# EAGLE design RS485-LoRa Wireless Station-V2.1 (EAGLE 6.1)
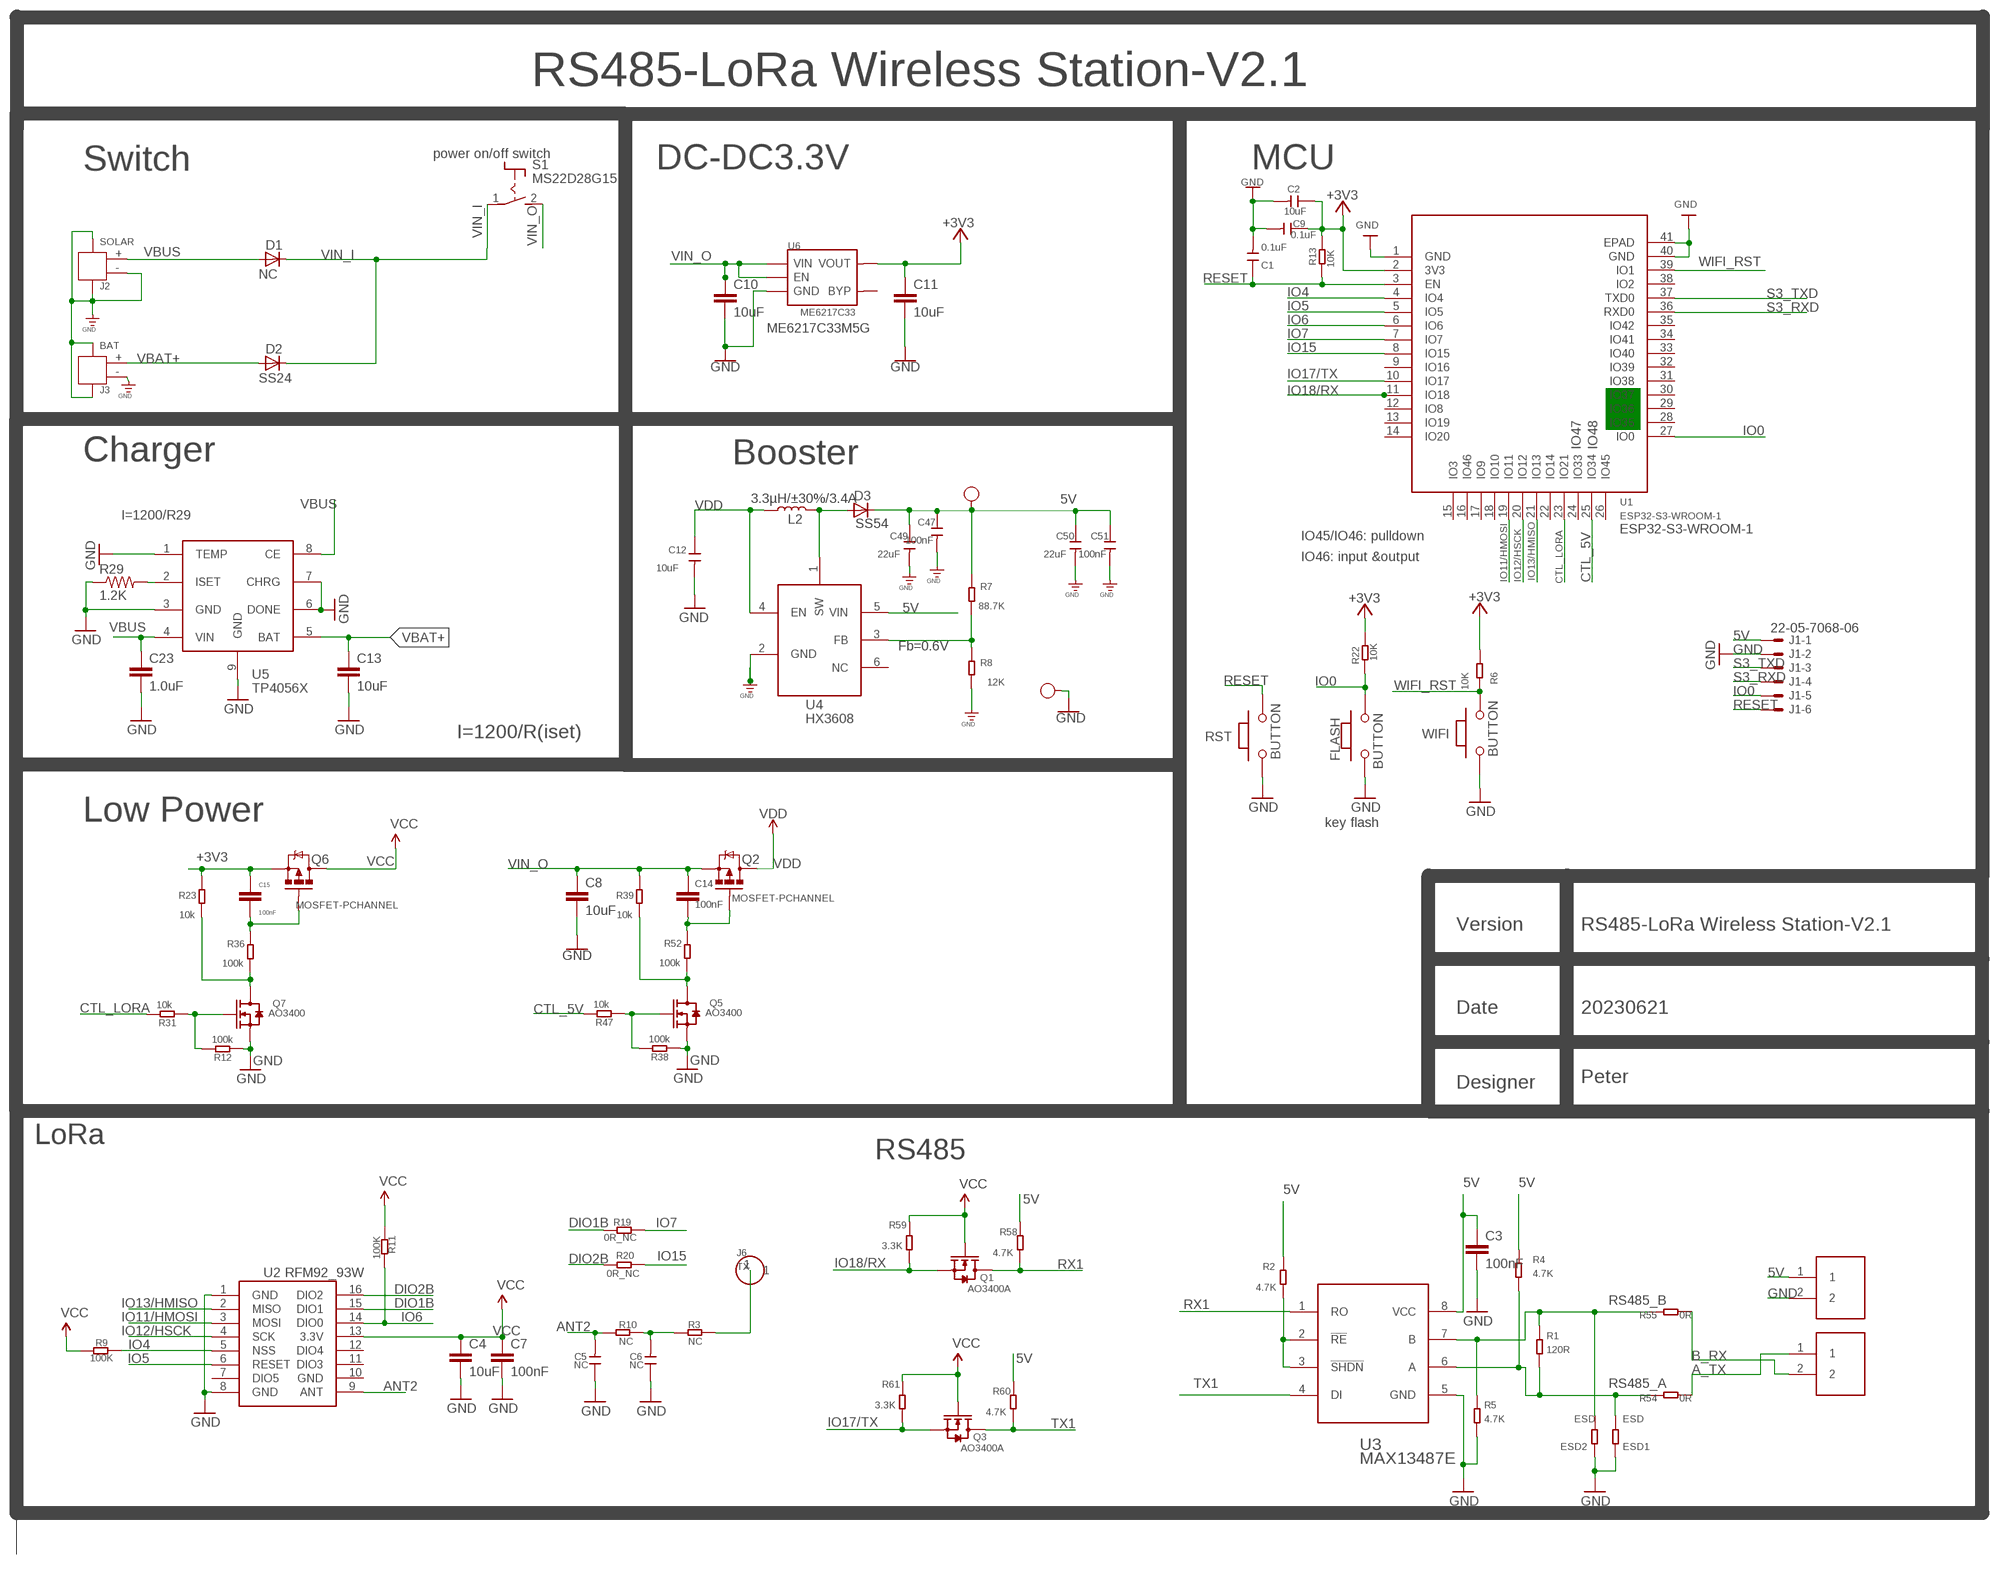
[diagram p0: schematic, sheet 1]

## Parts
5V  HP  TEST-POINT'4545'  [TP-D45MIL]
C1  0.1uF  DISCRETE_C-0603  [DISCRETE_C0603]
C2  10uF  DISCRETE_C-0603  [DISCRETE_C0603]
C3  100nF  C0603  [C0603]
C4  10uF  C0603  [C0603]
C5  NC  DISCRETE_C-0603  [DISCRETE_C0603]
C6  NC  DISCRETE_C-0603  [DISCRETE_C0603]
C7  100nF  C0603  [C0603]
C8  10uF  C0603  [C0603]
C9  0.1uF  DISCRETE_C-0603  [DISCRETE_C0603]
C10  10uF  C0603  [C0603]
C11  10uF  C0603  [C0603]
C12  10uF  CAP-0603  [C0603]
C13  10uF  C0603  [C0603]
C14  100nF  C0603  [C0603]
C15  100nF  C0603  [C0603]
C23  1.0uF  C0603  [C0603]
C47  100nF  CAP-0603  [C0603]
C49  22uF  CAP-0603  [C0603]
C50  22uF  CAP-0603  [C0603]
C51  100nF  CAP-0603  [C0603]
D1  NC  DIODE-DO-214AC  [DO-214AC]
D2  SS24  DIODE-DO-214AC  [DO-214AC]
D3  SS54  DIODE-DO-214AC  [DO-214AC]
ESD1  ESD  R-0603  [R0603]
ESD2  ESD  R-0603  [R0603]
FLASH  BUTTON  PB157  [157SW]
GND  HP  TEST-POINT'4545'  [TP-D45MIL]
J1  22-05-7068-06  [7395-06]
J2  SOLAR  JST-2P-SMD'2.0'  [HW2-SMD-2.0-90D]
J3  BAT  JST-2P-SMD'2.0'  [HW2-SMD-2.0-90D]
J4  PH2.0-2P-DIP  [PH2.0*2-DIP]
J5  PH2.0-2P-DIP  [PH2.0*2-DIP]
J6  TX  HEADER-1P-50  [1P-100/50MIL]
L2  3.3µH/±30%/3.4A  INDUCTOR-CR54-3.3UH  [CR54]
Q1  AO3400A  MOSFET-N'SOT23'  [SOT-23]
Q2  MOSFET-PCHANNEL  [SOT23-3]
Q3  AO3400A  MOSFET-N'SOT23'  [SOT-23]
Q5  AO3400  MOSFET-N'SOT23'  [SOT23@1]
Q6  MOSFET-PCHANNEL  [SOT23-3]
Q7  AO3400  MOSFET-N'SOT23'  [SOT23@1]
R1  120R  R-0603  [R0603]
R2  4.7K  R-0603  [R0603]
R3  NC  DISCRETE_R-0603  [DISCRETE_R0603]
R4  4.7K  R-0603  [R0603]
R5  4.7K  R-0603  [R0603]
R6  10K  R-0603  [R0603]
R7  88.7K  R-0603  [R0603]
R8  12K  R-0603  [R0603]
R9  100K  R-0603  [R0603]
R10  NC  DISCRETE_R-0603  [DISCRETE_R0603]
R11  100K  R-0603  [R0603]
R12  100k  R-0603  [R0603]
R13  10K  R-0603  [R0603]
R19  0R_NC  R-0603  [R0603]
R20  0R_NC  R-0603  [R0603]
R22  10K  R-0603  [R0603]
R23  10k  R-0603  [R0603]
R29  1.2K  R0603  [R0603]
R31  10k  R-0603  [R0603]
R36  100k  R-0603  [R0603]
R38  100k  R-0603  [R0603]
R39  10k  R-0603  [R0603]
R47  10k  R-0603  [R0603]
R52  100k  R-0603  [R0603]
R54  0R  R-0603  [R0603]
R55  0R  R-0603  [R0603]
R58  4.7K  R-0603  [R0603]
R59  3.3K  R-0603  [R0603]
R60  4.7K  R-0603  [R0603]
R61  3.3K  R-0603  [R0603]
RST  BUTTON  PB157  [157SW]
S1  MS22D28G15  [S-MS22D28G15]
U1  ESP32-S3-WROOM-1  ESP32­S2­SOLO  [ESP32-­S2-­SOLO]
U2  RFM92_93W  [RFM92_93W]
U3  MAX13487E  [DIP8_MAX13487]
U4  HX3608  [SOT-23-6]
U5  TP4056X  TP4056  [SOP8-1.27P]
U6  ME6217C33  SPX3819  [SOT23-5]
WIFI  BUTTON  PB157  [157SW]

## Nets
5V: 5V.T C3.1 C47.1 C49.1 C50.1 C51.1 D3.C J1.1 J4.1 R2.2 R4.2 R7.2 R58.2 R60.2 U3.8(VCC) U4.5(VIN)
+3V3: C2.1 C9.1 C11.1 C15.1 Q6.2(S) R6.2 R13.2 R22.2 R23.2 U1.2(3V3) U6.5(VOUT)
A_TX: J5.1 R54.1
ANT2: C5.2 R10.1 U2.9(ANT)
B_RX: J5.2 R55.1
CTL_5V: R47.2 U1.25(IO34)
CTL_LORA: R31.2 U1.23(IO21)
DIO1B: R19.2 U2.15(DIO1)
DIO2B: R20.2 U2.16(DIO2)
GND: C1.2 C2.2 C3.2 C4.2 C5.1 C6.1 C7.2 C8.2 C9.2 C10.2 C11.2 C12.2 C13.2 C23.2 C47.2 C49.2 C50.2 C51.2 ESD1.1 ESD2.1 FLASH.1 GND.T J1.2 J2.3 J2.4 J2.- J3.3 J3.4 J3.- J4.2 Q5.2(S) Q7.2(S) R5.1 R8.1 R12.1 R29.1 R38.1 RST.1 U1.1(GND) U1.40(GND) U1.41(EPAD) U2.1(GND) U2.8(GND) U3.5(GND) U4.2(GND) U5.1(TEMP) U5.3(GND) U5.6(DONE) U5.7(CHRG) U5.9(GND) U6.2(GND) WIFI.1
IO0: FLASH.2 J1.5 R22.1 U1.27(IO0)
IO4: R9.1 U1.4(IO4) U2.5(NSS)
IO5: U1.5(IO5) U2.6(RESET)
IO6: R11.1 U1.6(IO6) U2.14(DIO0)
IO7: R19.1 U1.7(IO7)
IO11/HMOSI: U1.19(IO11) U2.3(MOSI)
IO12/HSCK: U1.20(IO12) U2.4(SCK)
IO13/HMISO: U1.21(IO13) U2.2(MISO)
IO15: R20.1 U1.8(IO15)
IO17/TX: Q3.2(S) R61.1 U1.10(IO17)
IO18/RX: Q1.2(S) R59.1 U1.11(IO18)
ISET: R29.2 U5.2(ISET)
N$1: C6.2 R3.1 R10.2
N$2: J6.1 R3.2
N$11: C14.2 Q2.1(G) R52.2
N$12: Q5.1(G) R38.2 R47.1
N$13: C15.2 Q6.1(G) R36.2
N$14: Q7.1(G) R12.2 R31.1
N$18: Q7.3(D) R23.1 R36.1
N$23: D3.A L2.P$2 U4.1(SW)
N$25: R7.1 R8.2 U4.3(FB)
N$31: Q5.3(D) R39.1 R52.1
N$36: R2.1 U3.2(!RE) U3.3(!SHDN)
RESET: C1.1 J1.6 R13.1 RST.2 U1.3(EN)
RS485_A: ESD1.2 R1.1 R4.1 R54.2 U3.6(A)
RS485_B: ESD2.2 R1.2 R5.2 R55.2 U3.7(B)
RX1: Q1.3(D) R58.1 U3.1(RO)
S3_RXD: J1.4 U1.36(RXD0)
S3_TXD: J1.3 U1.37(TXD0)
TX1: Q3.3(D) R60.1 U3.4(DI)
VBAT+: C13.1 D2.A J3.+ U5.5(BAT)
VBUS: C23.1 D1.A J2.+ U5.4(VIN) U5.8(CE)
VCC: C4.1 C7.1 Q1.1(G) Q3.1(G) Q6.3(D) R9.2 R11.2 R59.2 R61.2 U2.13(3.3V)
VDD: C12.1 L2.P$1 Q2.3(D) U4.4(EN)
VIN_I: D1.C D2.C S1.1(P)
VIN_O: C8.1 C10.1 C14.1 Q2.2(S) R39.2 S1.2(S) U6.1(VIN) U6.3(EN)
WIFI_RST: R6.1 U1.39(IO1) WIFI.2
Unconnected: U1.9(IO16) U1.12(IO8) U1.13(IO19) U1.14(IO20) U1.15(IO3) U1.16(IO46) U1.17(IO9) U1.18(IO10) U1.22(IO14) U1.24(IO33) U1.26(IO45) U1.28(IO35) U1.29(IO36) U1.30(IO37) U1.31(IO38) U1.32(IO39) U1.33(IO40) U1.34(IO41) U1.35(IO42) U1.38(IO2) U2.7(DIO5) U2.11(DIO3) U2.12(DIO4) U4.6(NC) U6.4(BYP)

## Notes on the sheet
- RS485-LoRa Wireless Station-V2.1
- power on/off switch
- Switch | DC-DC3.3V | MCU
- ME6217C33M5G
- IO47 | IO48
- Charger | Booster
- I=1200/R29
- ESP32-S3-WROOM-1
- IO45/IO46: pulldown
- IO46: input &output
- Fb=0.6V
- I=1200/R(iset)
- Low Power
- key flash
- Version | RS485-LoRa Wireless Station-V2.1
- Date | 20230621
- Designer | Peter
- LoRa
- RS485

## Power pins joined to a net without a drawn wire
GND: U2.10(GND)

## Library data of the parts
5V GND = Discrete-new:TEST-POINT; PARTNO: DNP
C1 C2 C5 C6 C9 = A9G:DISCRETE_C*: Ceramic Capacitors
C3 C4 C7 C8 C10 C11 C13-C15 C23 = Makerfabs-Peter:C0603
C12 C47 C49-C51 = Discrete-new:CAP: Ceramic Capacitors
D1-D3 = diode:DIODE-: DIODE
ESD1 ESD2 R1 R2 R4-R9 R11-R13 R19 R20 R22 R23 R31 R36 R38 R39 R47 R52 R54 R55 R58-R61 = Discrete:R*
FLASH RST WIFI = MySMD:PB157
J1 = con-molex:22-?-06: CONNECTOR wire to board 2.54 mm (.1 inch) pitch header; OC_FARNELL: unknown; OC_NEWARK: unknown
J2 J3 = Connector-new:JST-2P-SMD: 2P-SMD-1.0-90D:320110054;2P-SMD-2.0-90D:320110026
J4 J5 = Makerfabs-Peter:PH2.0-2P-DIP
J6 = Connector:HEADER-1P
L2 = SparkFun-Coils:INDUCTOR: Inductors Resist changes in electrical current. Basically a coil of wire. SparkFun Products: SparkFun Load Cell Amplifier - HX711 <https://www.sparkfun.com/products/13879> IOIO-OTG - V2.2 <https://www.sparkfun.com/products/13613>; PROD_ID: NDUC-11157
Q1 Q3 = Discrete-new:MOSFET-N: IRLL014: http://www.vishay.com/docs/91319/sihll014.pdf
Q2 Q6 = User-Submitted:MOSFET-PCHANNEL: Generic PMOSFET IRLML2244 - TRANS-11153 (SOT-23 -20V -4.3A) (1.Gate 2.Source 3.Drain) FQP27P06 - COM-10349 <http://www.sparkfun.com/products/10349> (TO-220 -60V -27A) (1.Gate 2.Source 3.Drain); PROD_ID: TRANS-08285
Q5 Q7 = Discrete:MOSFET-N: IRLL014: http://www.vishay.com/docs/91319/sihll014.pdf
R3 R10 = A9G:DISCRETE_R*
R29 = Makerfabs-Peter:R0603
S1 = Makerfabs-Peter:MS22D28G15
U1 = self:ESP32­S2­SOLO
U2 = dragino:RFM92_93W
U3 = 1mytest:MAX13487E
U4 = self:HX3608
U5 = self:TP4056
U6 = IC:SPX3819

## Net classes
0 default: width 0.152 mm, drill 0.305 mm, clearance 0.152 mm

## Board
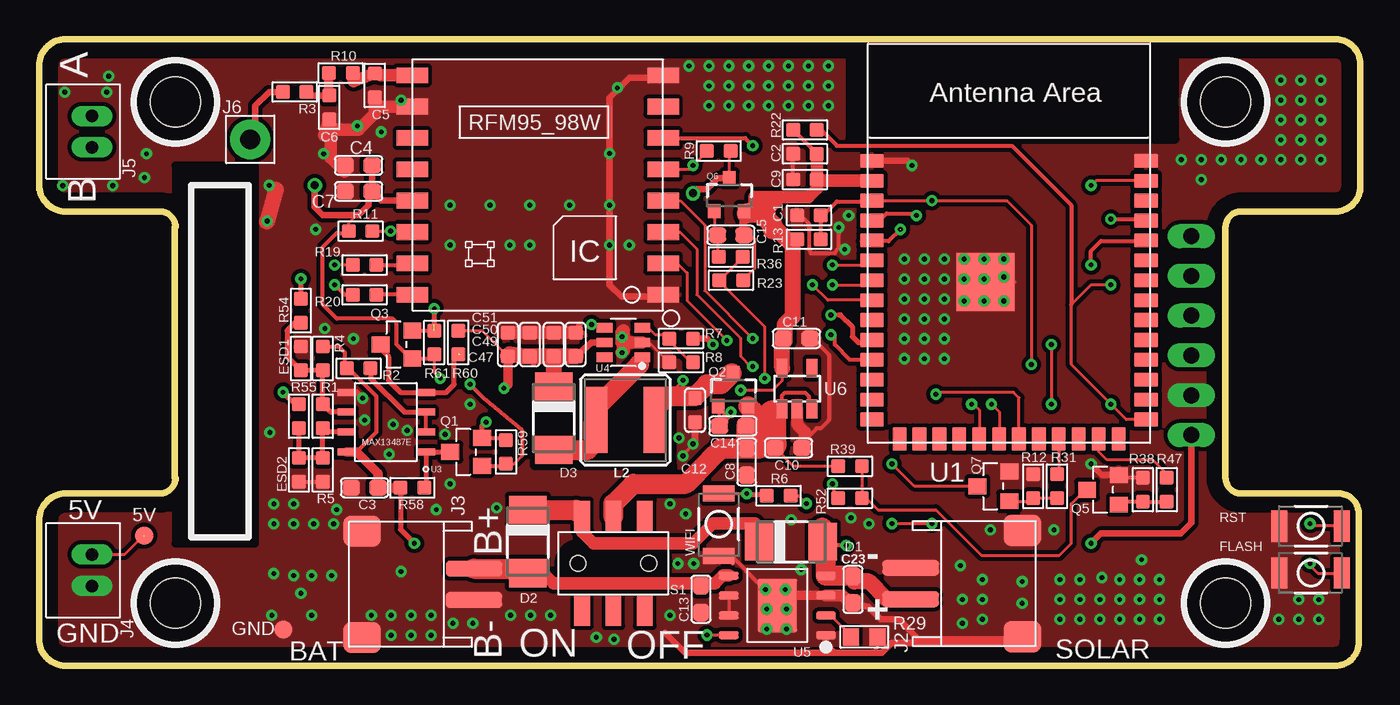
[diagram p1: board, top side]
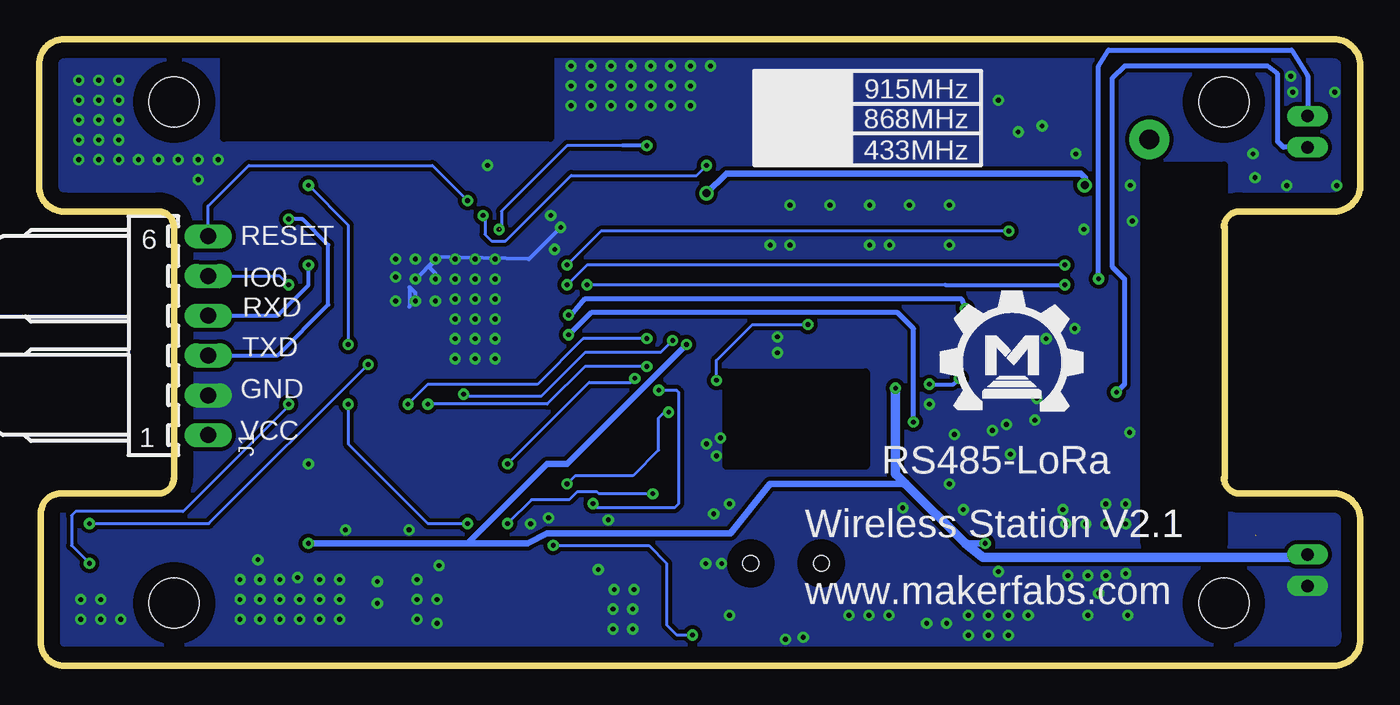
[diagram p2: board, bottom side, seen from below]

Size 84.3 x 40 mm. Coordinates in mm from the lower left corner, seen from the top.
Outline: 0,2.2 0,9.3 arc-90 1.7,11 7.7,11 arc90 8.7,12
Outline: 0,30.4 0,30.7
Outline: 0,30.7 0,38.3
Outline: 0,38.3 0,38.4
Outline: 84.3,30.6 84.3,38.4 arc90 82.7,40 1.7,40 arc90 0,38.3
Outline: 84.3,30.6 84.3,30.3
Outline: 84.2,9.9 84.2,9.7
Outline: 84.2,9.7 84.2,1.5 arc-90 82.7,0 1.7,0 arc-90 0,1.7 0,2.1
Outline: 8.7,28 arc90 7.7,29 1.7,29 arc-90 0,30.7
Outline: 84.3,30.6 arc-90 82.7,29 76.7,29 arc90 75.7,28 75.7,12 arc90 76.7,11 82.9,11 arc-90 84.2,9.7
Outline: 8.64,28 8.64,12
Copper layers (1*16): Top 0.035mm / dielectric 1.5mm / Bottom 0.035mm
Design rules: minimum track width 8mil, minimum drill 12mil, track to track 8mil, track to pad 8mil, pad to pad 8mil, via to via 8mil, smd to smd 0mil, copper to edge 40mil, drill to drill 8mil, minimum pad ring 10mil, minimum via ring 8mil, stop-mask expansion 4mil, vias tented up to drill 30mil, thermal gap 0mil
Holes 3.2 mm at 8.7,4 75.7,4 8.7,36 75.7,36
tRestrict: area 51.7,33.6 to 72.5,40; area 31.6,12.8 to 40.5,18.7; area 8.7,7.8 to 13.8,31.9
bRestrict: area 51.7,33.7 to 72.5,40; area 31.6,12.8 to 40.5,18.7; area 8.7,7.8 to 13.8,31.9

### Footprints (pad centres in the part's own frame; a part is rotated, then mirrored left to right if it is on the bottom)
TP-D45MIL = smd 1.143 x 1.143: T 0,0
DISCRETE_C0603 = smd 0.889 x 0.889: 1 -0.762,0; 2 0.762,0
C0603 = smd 1.1 x 1: 1 -0.85,0; 2 0.85,0
C0603' = smd 0.889 x 0.889: 1 0,0.762; 2 0,-0.762
DO-214AC = smd 1.8 x 2.4: A 2.025,0; C -2.025,0
R0603 = smd 0.889 x 0.889: 1 -0.762,0; 2 0.762,0
157SW = smd 1.016 x 1.981: 1 0,0; 2 4,0
7395-06 = drill 1.016 long: 1 6.35,0; 2 3.81,0; 3 1.27,0; 4 -1.27,0; 5 -3.81,0; 6 -6.35,0
HW2-SMD-2.0-90D = smd 2 x 2.4: 3 3.4,-2.181; 4 -3.4,-2.181 | smd 1 x 3.6: + -1,4.953; - 1,4.953
PH2.0*2-DIP = drill 0.8 long: 1 -1,0.55; 2 1,0.55
1P-100/50MIL = drill 1.27 pad 2.54: 1 0,0
CR54 = smd 4.2 x 1.4: P$1 0,1.85; P$2 0,-1.85
SOT-23 = smd 1.143 x 1.016: 1 1.016,-0.889; 2 1.016,0.889; 3 -1.016,0
SOT23-3 = smd 0.8 x 0.9: 1 -0.95,-1; 2 0.95,-1; 3 0,1.1
SOT23@1 = smd 1.016 x 1.143: 1 -0.95,-1.016; 2 0.95,-1.016; 3 0,1.016
DISCRETE_R0603 = smd 0.889 x 0.889: 1 -0.762,0; 2 0.762,0
R0603' = smd 1 x 1.1: 1 -0.85,0; 2 0.85,0
S-MS22D28G15 = smd 1 x 2: 1 -2,3; 2 0,3; 3 2,3; 4 2,-3; 5 0,-3; 6 -2,-3 | hole 1: 2.25,0; -2.25,0
ESP32-­S2-­SOLO = smd 1.5 x 0.9: 1 -8.75,5.26; 2 -8.75,3.99; 3 -8.75,2.72; 4 -8.75,1.45; 5 -8.75,0.18; 6 -8.75,-1.09; 7 -8.75,-2.36; 8 -8.75,-3.63; 9 -8.75,-4.9; 10 -8.75,-6.17; 11 -8.75,-7.44; 12 -8.75,-8.71; 13 -8.75,-9.98; 14 -8.75,-11.25; 27 8.75,-11.25; 28 8.75,-9.98; 29 8.75,-8.71; 30 8.75,-7.44; 31 8.75,-6.17; 32 8.75,-4.9; 33 8.75,-3.63; 34 8.75,-2.36; 35 8.75,-1.09; 36 8.75,0.18; 37 8.75,1.45; 38 8.75,2.72; 39 8.75,3.99; 40 8.75,5.26 | smd 0.9 x 1.5: 15 -6.985,-12.5; 16 -5.715,-12.5; 17 -4.445,-12.5; 18 -3.175,-12.5; 19 -1.905,-12.5; 20 -0.635,-12.5; 21 0.635,-12.5; 22 1.905,-12.5; 23 3.175,-12.5; 24 4.445,-12.5; 25 5.715,-12.5; 26 6.985,-12.5 | smd 3.7 x 3.7: 41 -1.5,-2.46
RFM92_93W = smd 2 x 1: 1 -8,7; 2 -8,5; 3 -8,3; 4 -8,1; 5 -8,-1; 6 -8,-3; 7 -8,-5; 8 -8,-7; 9 8,-7; 10 8,-5; 11 8,-3; 12 8,-1; 13 8,1; 14 8,3; 15 8,5; 16 8,7
DIP8_MAX13487 = smd 1.1 x 0.45: 1 1.27,3.81; 2 1.27,2.54; 3 1.27,1.27; 4 1.27,0; 5 6.39,0; 6 6.39,1.27; 7 6.39,2.54; 8 6.39,3.81
SOT-23-6 = smd 1 x 0.6: 1 -1.2,0.95; 2 -1.2,0; 3 -1.2,-0.95; 4 1.2,-0.95; 5 1.2,0; 6 1.2,0.95
SOP8-1.27P = smd 1.27 x 0.51: 1 -3.1,1.905; 2 -3.1,0.635; 3 -3.1,-0.635; 4 -3.1,-1.905; 5 3.1,-1.905; 6 3.1,-0.635; 7 3.1,0.635; 8 3.1,1.905 | smd 2.5 x 3.4: 9 0,0
SOT23-5 = smd 0.69 x 1.2: 1 -0.95,-1.3; 2 0,-1.3; 3 0.95,-1.3; 4 0.95,1.3; 5 -0.95,1.3

### Placement (x,y rotation side)
5V  6.7,8.3 90 top
C1  49.12,28.75 180 top
C2  48.86,32.69 180 top
C3  20.77,11.37 180 top
C4  20.38,31.94 180 top
C5  21.41,37.05 90 top
C6  18.51,35.64 90 top
C7  20.38,30.29 180 top
C8  45.15,13.02 270 top
C9  48.86,31.04 180 top
C10  47.82,13.91 0 top
C11  48.32,20.89 0 top
C12  10uF  [C0603']  41.85,16.32 0 top
C13  42.23,4.25 270 top
C14  44.26,15.3 180 top
C15  44.13,27.5 180 top
C23  51.93,4.87 270 top
C47  100nF  [C0603']  34.23,20.51 180 top
C49  22uF  [C0603']  32.83,20.51 180 top
C50  22uF  [C0603']  31.31,20.51 180 top
C51  100nF  [C0603']  29.91,20.51 180 top
D1  47.97,7.92 0 top
D2  31.18,7.94 270 top
D3  32.83,15.81 270 top
ESD1  16.7,19.62 270 top
ESD2  16.57,12.51 90 top
FLASH  79.12,5.93 0 top
GND  15.57,2.31 270 top
J1  73.52,21.08 270 bottom
J2  60.56,5.25 90 top
J3  22.79,5.21 270 top
J4  2.81,6.1 270 top
J5  2.81,34.1 270 top
J6  13.47,33.6 0 top
L2  37.4,15.68 270 top
Q1  27.24,13.65 0 top
Q2  44.29,17.57 0 top
Q3  22.8,20.51 0 top
Q5  67.88,11.24 90 top
Q6  44.04,30.02 0 top
Q7  60.88,11.46 90 top
R1  18.1,15.94 270 top
R2  20.38,18.99 180 top
R3  16.3,36.63 180 top
R4  18.1,19.62 90 top
R5  18.1,12.51 90 top
R6  47.18,10.86 0 top
R7  40.96,20.89 0 top
R8  40.96,19.37 0 top
R9  43.36,32.86 0 top
R10  19.24,37.84 180 top
R11  20.51,27.75 180 top
R12  63.42,11.46 270 top
R13  49.12,27.23 180 top
R19  20.77,25.59 0 top
R20  20.77,23.68 0 top
R22  48.86,34.21 180 top
R23  44.15,24.61 0 top
R29  1.2K  [R0603']  52.64,1.84 180 top
R31  64.94,11.46 90 top
R36  44.13,26.1 180 top
R38  70.42,11.24 270 top
R39  51.74,12.73 180 top
R47  71.95,11.24 90 top
R52  51.74,10.7 180 top
R54  16.7,22.67 270 top
R55  16.57,15.94 270 top
R58  23.81,11.37 180 top
R59  29.78,13.65 270 top
R60  26.73,20.64 90 top
R61  25.21,20.64 270 top
RST  79.12,8.92 0 top
S1  36.64,6.54 0 top
U1  61.88,26.97 0 top
U2  31.81,30.69 180 top
U3  25.97,17.46 180 top
U4  37.27,20.64 180 top
U5  47.1,3.85 180 top
U6  48.36,17.7 0 top
U$3  [MAKERFABS_0.3]  26.35,16.32 0 bottom
WIFI  43.36,7.01 90 top

### Tracks (layer width: path | path; a pad name or v marks a point on that pad's centre or on a via)
5V  (via drill 0.3)  (1 unrouted)
  Top 0.203: 19.62,13.65 U3.8 | R60.2 28.26,21.4 C51.1 | J4.1 5.45,7.1 6.67,8.32
  Top 0.254: C49.1 32.07,19.75 31.56,19.24 30.93,19.75 31.18,19.88 C50.1 | D3.C 32.83,17.97 | R4.2 19.11,20.38 19.49,20 19.49,19.11 R2.2 19.75,18.99 21.53,17.21 21.53,14.92 20.26,13.65
  Top 0.305: R58.2 23.05,8.7 v23.94,7.81
  Top 0.406: U4.5 35.24,20.64 C47.1 | R7.2 42.61,20.89 v42.99,20.51 | J1.1 73.52,9.13 72.84,8.45 67.75,8.45 v67.12,7.81
  Top 0.61: C51.1 29.91,17.97 v29.65,17.72 | 19.62,13.65 20.26,13.65 21.61,12.29 C3.1 R58.2
  Top 1.016: C49.1 32.83,17.97 | C47.1 30.93,19.75 30.04,19.88 C51.1
  Bottom 0.406: v23.94,7.81 25.21,7.81 | v67.12,7.81 56.96,7.81 | 56.96,7.81 51.88,12.89 50.61,12.89 v42.99,20.51 | 29.02,11.62 37.66,11.62 40.2,8.45 51.88,8.45 53.15,7.81 56.96,7.81
  Bottom 0.61: v29.65,17.72 29.65,12.26 29.02,11.62 25.21,7.81 24.07,6.92 3.54,6.92 J4.1
+3V3  (via drill 0.3)
  Top 0.203: C9.1 49.34,30.75 49.34,30.67 | 44.89,28.64 45.15,28.89 45.11,28.89 Q6.2 | R13.2 47.83,27.23 47.44,27.62 47.05,27.62 46.8,27.88 | R23.2 45.66,25.35 45.66,27.24 45.29,27.61 45.18,27.5 C15.1 44.89,27.5 | 47.41,20.61 47.41,20.82 C11.1 | 47.41,20.56 47.41,20.61 | 47.41,20.61 47.44,20.64 | U6.5 47.41,18.2 46.8,17.59 v44.77,17.59 | v48.96,10.35 48.45,10.86 R6.2 47.94,11.11
  Top 0.254: 49.88,32.94 C2.1 R22.2
  Top 0.508: 44.89,28.64 44.89,27.5
  Top 0.813: 45.15,28.89 45.66,29.4 45.66,29.91 47.34,29.91 | 47.34,29.91 46.71,29.27 46.29,29.27 | 47.34,29.91 49.09,29.91 49.63,30.45 C9.1 | C9.1 C2.1 | C9.1 49.7,30.96 U1.2
  Top 1.016: U6.5 47.41,20.56 | 46.8,27.88 47.05,27.88 48.07,26.86 48.07,22.29 47.56,21.78 47.56,20.76 47.44,20.64
  Top 1.27: 46.8,27.88 46.8,28.13 46.04,28.89 45.15,28.89
  Bottom 0.203: v48.96,10.35 48.7,10.1 43.75,10.1 43.5,10.35 43.5,17.46 43.62,17.59 v44.77,17.59
A_TX  (via drill 0.3)
  Top 0.305: 16.7,23.3 R54.1 v16.7,24.7
  Bottom 0.305: v16.7,24.7 16.7,38.29 16.07,39.31 4.38,39.31 3.37,37.66 J5.1
ANT2
  Top 0.813: R10.1 20.07,37.31 C5.2 21.79,37.69 U2.9
B_RX  (via drill 0.3)
  Top 0.203: R55.1 16.32,16.7
  Top 0.305: v15.56,17.46 16.32,16.7
  Bottom 0.305: v15.56,17.46 15.05,17.97 15.05,24.7 15.81,25.46 15.81,37.53 15.05,38.29 5.91,38.29 5.27,37.78 5.27,33.46 4.91,33.1 J5.2
CTL_5V
  Top 0.203: R47.2 71.95,12.26 71.06,13.14 68.14,13.14 67.63,13.65 67.63,14.44 U1.25
CTL_LORA
  Top 0.203: U1.23 65.06,12.34 R31.2
DIO1B
  Top 0.254: R19.2 23.71,25.59 U2.15
DIO2B
  Top 0.254: U2.16 R20.2
GND  (via drill 0.3)
  Top 0.203: J2.4 62.92,1.85 | 62.92,1.85 63.31,1.46 | 62.85,1.95 62.85,1.92 62.92,1.85 | R29.1 53.49,1.17 53.15,0.83 | U4.2 38.93,20.64 R8.1 | v46.34,4.87 46.4,4.87 46.65,5.12 | 46.34,5.12 46.65,5.12 | 46.65,5.12 46.8,5.27 46.8,4 v46.42,3.62 | v46.42,3.62 v47.69,3.62 46.8,2.73 47.31,2.73 v47.69,2.35 | v46.42,3.62 v46.42,2.35 | v41.72,14.16 v41.08,13.4 | U5.6 U5.7
  Top 0.254: U5.1 50.33,1.82 | ESD2.1 R5.1 | R38.1 69.09,12 Q5.2 | C9.2 C2.2 | U1.40 | U2.8 40.03,37.69 40.2,37.53 | 63.23,8.04 62.72,8.55 62.75,8.57 | 62.85,8.68 62.77,8.68 J2.3 | 48.86,14.4 49.63,15.16 49.88,15.16 50.39,15.67 50.39,19.86 49.37,20.88 | C1.2 48.61,28.75 49.12,28.24 49.12,26.59 49.25,26.34 50.77,26.34 51.02,26.72 v51.02,27.99 | 62.12,24.51 61.74,24.64 v61.56,24.81 61.44,24.81 | 61.44,24.81 v60.29,25.95 | 61.44,24.81 61.44,25.83 v61.56,25.95 | v61.56,23.29 v60.29,23.29 59.66,23.29 | 46.72,4.49 46.72,4.24 U5.9 47.1,4.36 v47.61,4.87 | WIFI.1 43.79,7.01 44.26,6.54 | 46.8,5.27 45.91,5.27 44.26,6.92 43.37,6.92
  Top 0.406: U2.1 39.68,23.56 37.15,23.56 36.39,24.32 v36.39,29.4 v36.39,32.7 36.39,36.26 37.66,37.53 40.2,37.53 | U1.41 62.12,24.51 | 34.35,21.27 C47.2 34.48,21.78 | C23.2 52.91,3.77 53.71,2.96 54.85,2.96 56.12,1.69 62.6,1.69 62.85,1.95 62.85,2.33 | U5.1 50.2,1.36 50.74,0.83 | 50.74,0.83 53.15,0.83 53.78,0.83 54.42,1.46 63.31,1.46 | U3.5 20.26,17.46 v20.64,17.08 | U1.1 55.4,32.23 v55.69,31.94 | C12.2 41.85,14.29 v41.72,14.16 | Q5.2 67.82,12.19 v67.12,12.89 | 50.74,0.83 41.21,0.83 39.94,2.09
  Top 0.61: U5.3 46.72,4.49 v46.34,4.87 | 62.75,8.57 62.85,8.68 62.09,8.68
  Top 0.762: U5.3 51.2,4.49 C23.2 | U6.2 48.36,15.41 48.86,14.91
  Top 0.813: 48.86,14.91 48.86,14.4 | v46.34,4.87 46.34,5.12 | C6.1 18.19,33.86 | C6.1 18.56,34.23 20.38,34.23 21.41,35.25 C5.1 21.51,35.69 U2.10 | C6.1 18.61,33.88 18.61,32.45 19.49,31.56 | C51.2 C50.2 C49.2 34.35,21.27 | U4.2 37.15,20.64 37.15,21.27 37.27,21.4 37.27,20.13 37.15,20
  Top 1.016: 15.1,30.37 v14.54,28.38
  Bottom 0.254: v51.02,27.99 53.05,25.95 58.9,26.08 v59.02,25.95 59.02,25.93 | 59.02,25.93 60.32,24.64 | 59.02,25.93 59.02,25.83 59.41,25.45 59.02,25.07 v59.02,24.68 | v60.29,23.29 60.29,23.8 60.67,24.18 60.67,22.91
  other vias: 58.91,4.24 70.34,6.78 16.7,4.63 36.89,36.89 60.29,24.68 14.67,30.67 59.02,23.29 62.72,3.98 62.72,5.38 67.8,5.63 37.2,19.98 37.2,21 18.23,21.53 20.77,15.68 58.79,6.39 64.75,8.68 66.41,2.96 60.69,8.68 74.15,31.03 40.24,10.33 41.26,9.7 51.8,9.44 52.94,9.06 47.99,9.32 58.91,2.71 48.63,6.14 40.83,14.54 40.75,6.52 40.24,3.22 41.77,6.52 51.4,26.59 51.66,28.75 30.08,3.22 31.35,3.22 32.62,3.22 35.55,1.82 36.69,1.69 21.19,3.22 22.46,3.22 25,3.22 23.73,3.22 25,1.95 23.73,1.95 22.46,1.95 17.38,3.22 14.84,3.22 14.72,14.9 6.84,32.68 6.72,31.16 1.64,36.62 4.68,30.65 1.51,30.65 4.3,36.62 17.64,27.86 18.15,32.68 55.21,25.95 56.48,25.95 57.75,25.95 57.75,24.68 57.75,23.41 57.75,22.14 57.75,20.88 57.75,19.61 56.48,19.61 55.21,19.61 56.48,20.88 55.21,20.88 56.48,22.14 55.21,22.14 56.48,23.41 55.21,23.41 56.48,24.68 55.21,24.68 33.85,29.4 31.31,29.4 28.77,29.4 26.23,29.4 29.2,10.08 26.4,2.71 27.67,2.71 23.1,6.01 22.59,15.41 22.34,13.51 25.89,14.78 23.48,15.03 20.05,20.87 14.97,10.33 16.24,10.33 17.51,9.06 16.24,9.06 14.97,9.06 18.78,9.06 18.65,5.76 17.38,5.76 16.24,5.76 14.97,5.89 4.43,37.64 23.1,36.11 20.3,34.46 21.83,34.08 79.23,37.38 80.5,37.38 81.77,37.38 81.77,36.11 81.77,34.84 81.77,33.57 81.77,32.3 80.5,32.3 79.23,32.3 80.5,33.57 79.23,33.57 80.5,34.84 79.23,34.84 80.5,36.11 79.23,36.11 77.96,32.3 76.69,32.3 75.42,32.3 74.15,32.3 72.88,32.3 67.68,2.96 68.95,2.96 70.22,2.96 71.49,2.96 71.49,4.24 71.49,5.5 70.22,4.24 68.95,4.24 67.68,4.24 66.41,4.24 66.41,5.5 65.14,5.5 65.14,4.24 65.14,2.96 68.95,5.5 70.22,5.5 81.65,2.96 81.65,4.24 80.38,2.96 79.11,2.96 80.38,4.24 60.18,4.24 60.18,2.96 60.18,5.5 41.47,38.29 42.74,38.29 44.01,38.29 45.28,38.29 46.55,38.29 47.82,38.29 49.09,38.29 50.36,38.29 50.36,37.02 50.36,35.75 49.09,35.75 47.82,35.75 46.55,35.75 44.01,35.75 45.28,35.75 42.74,35.75 42.74,37.02 44.01,37.02 45.28,37.02 46.55,37.02 47.82,37.02 49.09,37.02 31.31,26.86 36.39,26.86 26.23,26.86 30.04,26.86 37.66,26.86 27.5,16.7 26.23,11.62 25.34,9.97 18.99,9.97
  pour Bottom (isolate 0.254, rank 6): -4,49.72 92.52,49.72 92.52,42.1 92.52,-6.16 -4,-6.16
  pour Top (isolate 0.254, rank 6): -1.46,47.18 89.98,47.18 89.98,39.56 89.98,-3.62 -1.46,-3.62
IO0  (via drill 0.3)
  Top 0.203: U1.27 69.37,15.72 v68.39,16.7 65.85,19.24 65.85,23.05 67.12,24.32 v68.39,24.32 | v81.09,6.54 81.09,6.41 81.6,5.91 83.12,5.91 FLASH.2
  Top 0.254: R22.1 49.88,34.21 50.9,33.19 62.06,33.19 65.85,29.4 65.85,23.05
  Bottom 0.203: J1.5 69.34,24.89 69.34,24.91 68.98,24.91 v68.39,24.32 | v68.39,16.7 68.39,16.57 75.12,9.84 81.98,9.84 82.23,9.59 82.23,7.68 v81.09,6.54
IO4  (via drill 0.3)
  Top 0.203: R9.1 42.6,32.82 v41.72,31.94 41.47,31.69 U2.5
  Top 0.254: 39.18,31.94 39.43,31.69 U2.5 | U1.4 53.62,28.42 54.07,28.88 55.85,28.88 v55.98,28.75
  Bottom 0.203: 55.85,28.88 55.85,27.53 55.44,27.11 54.55,27.11 50.36,31.3 42.36,31.3 v41.72,31.94
  Bottom 0.254: 55.85,28.88 v55.98,28.75
IO5  (via drill 0.3)  (1 unrouted)
  Top 0.254: v54.96,27.86 54.2,27.1 52.49,27.1 U1.5 | U2.6 45.05,33.69 v45.53,33.21
  Bottom 0.203: 47.07,33.21 50.61,33.21 54.8,29.02 54.8,28.13 55.05,27.88 54.93,27.88
  Bottom 0.254: v45.53,33.21 47.07,33.21
IO6  (via drill 0.3)
  Top 0.203: R11.1 v22.42,27.75 23.56,27.75 23.94,28.13 23.94,27.82 U2.14 | v50.61,25.59 53.15,25.59 53.13,25.61 U1.6
  Bottom 0.203: v22.42,27.75 48.45,27.75 v50.61,25.59
IO7  (via drill 0.3)
  Top 0.203: R19.1 v18.86,25.59 | v50.61,24.32 52.84,24.32 U1.7
  Bottom 0.203: v18.86,25.59 49.34,25.59 v50.61,24.32
IO11/HMOSI  (via drill 0.3)
  Top 0.203: U2.3 40.89,27.69 41.97,26.61 41.97,23.68 44.77,20.89 44.77,19.75 45.4,19.11 v45.53,19.11 | v59.5,16.7 59.63,16.7 60.01,16.32 60.01,14.5 U1.19
  Bottom 0.203: v45.53,19.11 49.47,19.11 51.88,16.7 v59.5,16.7
IO12/HSCK  (via drill 0.3)
  Top 0.203: U2.4 40.92,29.69 42.48,28.13 42.48,23.94 v45.53,20.89 | v60.77,16.7 61.28,16.19 61.28,14.5 U1.20
  Bottom 0.203: v45.53,20.89 49.59,20.89 52.52,17.97 59.5,17.97 v60.77,16.7
IO13/HMISO  (via drill 0.3)
  Top 0.203: U2.2 40.73,25.69 41.34,25.08 41.34,23.3 v43.88,20.76 | U1.21 62.52,17.11 62.17,17.46 57.34,17.46 v57.21,17.34
  Top 0.254: U2.2 39.71,25.59
  Bottom 0.203: v43.88,20.76 44.64,20 49.47,20 52.26,17.21 57.09,17.21 v57.21,17.34
IO15  (via drill 0.3)
  Top 0.203: U1.8 50.32,23.34 v49.34,24.32
  Top 0.254: R20.1 19.49,23.68 v18.86,24.32
  Bottom 0.203: 26.48,24.32 v49.34,24.32
  Bottom 0.254: 26.48,24.32 v18.86,24.32
IO17/TX  (via drill 0.3)  (1 unrouted)
  Top 0.254: Q3.2 R61.1 | 51.02,22.4 v50.52,22.4
  Top 0.305: v25.21,22.8 25.21,21.78 | 51.02,22.4 51.13,22.4 51.88,21.65 51.88,21.02 52.26,20.64 52.97,20.64 U1.10
  Bottom 0.254: 50.39,22.53 v50.52,22.4 50.64,22.27
  Bottom 0.305: 50.39,22.53 50.25,22.53 49.47,23.43 25.46,23.43 v25.21,22.8
IO18/RX  (via drill 0.3)
  Top 0.254: Q1.2 29.65,14.54 R59.1 | U1.11 51.73,19.53 50.77,20.49 50.77,21 v50.52,21.13
  Top 0.305: Q1.2 28.26,15.3 v28.51,15.56
  Bottom 0.203: 50.48,21.14 50.5,21.14 v50.52,21.13
  Bottom 0.305: v28.51,15.56 28.51,21.53 29.53,22.54 49.09,22.54 50.48,21.14
ISET
  Top 0.203: U5.2 50.5,3.22 51.88,1.84 R29.2
N$1
  Top 0.203: C6.2 18.5,36.4 18.48,36.38
  Top 0.406: C6.2 17.29,36.4 R3.1
  Top 0.61: R10.2 18.48,36.39 18.48,36.38
N$2
  Top 0.406: R3.2 14.66,36.63 13.78,35.75 13.78,33.91 J6.1
N$11  (via drill 0.3)
  Top 0.203: Q2.1 43.37,16.57 43.41,16.53 C14.2 43.41,15.47 | v50.61,11.62 50.61,11.32 R52.2
  Top 0.508: 43.41,15.47 v44.13,16.19
  Bottom 0.203: v50.61,11.62 50.1,12.13 46.42,12.13 44.77,13.78 44.77,15.81 44.39,16.19 v44.13,16.19
N$12
  Top 0.254: R47.1 R38.2 69.09,10.48 Q5.1
N$13
  Top 0.203: Q6.1 43.09,27.91 43.37,27.62 | R36.2 43.4,26.13 43.4,26.19 43.28,26.31 43.33,26.31 43.37,26.35 43.28,26.44 C15.2 43.28,27.53 43.37,27.62 | 43.37,27.62 43.39,27.62
N$14
  Top 0.203: R31.1 R12.2 63.23,10.51 Q7.1
N$18  (via drill 0.3)
  Top 0.203: R36.1 43.4,24.61 R23.1 43.39,24.56 46.29,21.65 v46.29,18.35 | Q7.3 55.85,11.46 v54.42,12.89
  Bottom 0.203: v54.42,12.89 49.21,18.1 46.55,18.1 v46.29,18.35
N$23
  Top 0.203: 38.29,19.24 38.29,19.5 U4.1
  Top 0.254: L2.P$2 35.55,15.61 35.37,15.43
  Top 1.27: D3.A 35,13.79 35.37,14.16 35.37,15.43 35.37,15.5 L2.P$2 35.55,16.5 38.29,19.24
N$25
  Top 0.203: U4.3 38.86,21.59 39.31,21.14 39.94,21.14 R7.1 40.2,20.76 41.59,19.37 R8.2
N$31
  Top 0.203: R39.1 R52.1 52.8,10.7 53.53,9.97 57.21,9.97 60.14,7.05 65.09,7.05 65.85,7.81 65.85,10.35 67.12,11.62 67.12,11.49 Q5.3
N$36
  Top 0.254: U3.2 U3.3
  Top 0.305: R2.1 21.15,18.35 23.3,16.19 U3.3
RESET  (via drill 0.3)
  Top 0.203: U1.3 v56.96,29.69 61.75,29.69 63.31,28.13 v63.31,19.24 | RST.2 81.25,8.92 v81.09,9.08
  Top 0.254: R13.1 C1.1 50.01,28.75 50.9,29.64 52.38,29.64 U1.3
  Bottom 0.203: J1.6 73.52,29.35 70.93,31.94 59.21,31.94 v56.96,29.69 | v81.09,9.08 73.47,9.08 v63.31,19.24
RS485_A
  Top 0.305: U3.6 18.61,16.19 R1.1 R4.1 ESD1.2 15.81,19.75 15.81,21.4 16.32,21.91 R54.2
RS485_B
  Top 0.305: U3.7 18.35,14.92 R1.2 R5.2 ESD2.2 R55.2
RX1
  Top 0.305: Q1.3 U3.1 24.7,11.49 R58.1
S3_RXD  (via drill 0.3)
  Top 0.254: v67.12,25.59 67.12,26.48 67.75,27.11 70.6,27.11 U1.36
  Bottom 0.254: J1.4 69.09,22.35 67.12,24.32 v67.12,25.59
S3_TXD  (via drill 0.3)
  Top 0.203: U1.37 70.68,28.38
  Top 0.254: v68.39,28.51 70.55,28.51 70.68,28.38
  Bottom 0.254: J1.3 69.09,19.81 65.85,23.05 65.85,26.86 67.5,28.51 v68.39,28.51
TX1  (1 unrouted)
  Top 0.305: 26.86,19.88 26.48,19.49 26.48,17.97 25.97,17.46 U3.4 23.05,17.46 22.29,18.22 22.29,19.75 21.78,20.26 Q3.3
VBAT+
  Top 0.203: 31.43,5.91 D2.A | 44.01,5.78 44,5.77 U5.5 | 43.62,5.78 43.5,5.78 42.99,5.27 42.39,5.27 C13.1
  Top 0.813: 31.43,6.21 31.89,6.21 32.83,5.27 42.99,5.27 43.12,5.27 43.62,5.78 44.01,5.78
  Top 1.27: J3.+ 31.43,6.21 31.43,5.91
VBUS  (via drill 0.3)
  Top 0.203: D1.A 49.99,8.81 49.97,8.83 | U5.8 42.63,1.95 v42.61,1.97
  Top 0.254: v51.5,7.68 50.2,7.68
  Top 1.016: J2.+ 54.07,4.25 52.94,5.38 52.02,5.38 C23.1
  Top 1.27: C23.1 51.64,5.76 U5.4 50.2,7.68 50.2,8.6 49.97,8.83
  Bottom 0.203: v51.5,7.68 45.4,7.68 44.26,6.54 44.26,2.6 43.62,1.97 v42.61,1.97
VCC  (via drill 0.3, 0.51)
  Top 0.203: C7.1 21.15,30.29 21.02,30.16 | R11.2 19.75,28.26 20.13,28.64 20.13,28.77 | R59.2 30.29,12.89 30.8,13.4 | Q6.3 44.04,32.99 44.12,33.07 | R9.2 44.12,33.07 | 44.12,33.07 44.26,33.21 | 25.21,20 25.21,18.73 v25.59,18.35
  Top 0.254: Q1.1 29.4,12.76 29.53,12.89 R59.2 | R61.2 24.96,19.62 Q3.1 23.69,19.62 22.8,20.51 22.8,21.91 22.54,22.16 18.99,22.16 18.1,23.05 18.1,26.73 18.99,27.62 19.62,27.62 R11.2 | 25.08,20.13 25.08,19.88 R61.2 | R61.2 25.21,20 | 30.8,13.4 30.8,15.05 28.38,17.08 v27.5,17.97
  Top 0.406: U2.13 21.83,29.69 C7.1 C4.1 | v17.59,30.67 17.59,29.27 18.1,28.77 20.13,28.77 20.38,28.77 21.02,29.4 21.02,30.16 21.02,30.29 21.15,30.42 | Q6.3 43.31,31.12 42.61,30.42 41.97,30.42 v41.72,30.16
  Bottom 0.254: v27.5,17.97 25.97,17.97 v25.59,18.35
  Bottom 0.406: v17.59,30.67 17.59,31.18 17.84,31.43 40.45,31.43 v41.72,30.16
VDD  (via drill 0.3)
  Top 0.203: U4.4 35.69,21.59 35.37,21.91 v35.24,21.78 | 40.07,17.21 v41.08,18.22 | 39.18,16.32 39.18,15.76 L2.P$1 | 41.85,17.21 C12.1 | Q2.3 44.2,18.67
  Top 1.27: 44.2,18.67 43.5,17.97 42.61,17.97 41.85,17.21 40.07,17.21 39.18,16.32
  Bottom 0.203: v41.08,18.22 41.08,19.49 38.8,21.78 v35.24,21.78
VIN_I
  Top 0.203: 34.48,9.71 34.48,9.7 S1.1
  Top 0.813: S1.1 34.64,8.54 35.37,7.81 41.72,7.81 42.99,9.08 45.68,9.08 D1.C
  Top 1.27: D2.C 34.23,9.96 34.48,9.71
VIN_O
  Top 0.203: C10.1 46.97,13.99 46.8,14.16 | U6.1 47.14,16.4 47.05,16.32 | 46.66,14.02 46.86,14.02 C10.1 | 45.53,15.43 45.8,15.43 46.2,15.03 46.2,14.83 45.53,14.16 | 45.53,14.16 45.44,14.16 C8.1 | R39.2 48.14,12.73 C10.1 | 45.53,14.16 46.8,14.16 | 46.2,14.02 46.66,14.02 | 46.66,14.02 46.8,14.16
  Top 0.254: U6.1 47.41,17.26 47.59,17.45 48.86,17.45 49.12,17.19 49.12,16.59 U6.3 | 43.28,13.64 42.77,13.13 | 43.53,13.89 43.78,13.89 44.17,14.27 44.67,14.27 | 46.2,14.02 46.07,13.89
  Top 1.27: 46.07,13.89 43.53,13.89 42.77,13.13 41.26,11.62 37.91,11.62 36.64,10.35 S1.2 | 46.8,16.06 47.05,16.32 | C14.1 45.11,14.58 45.53,14.16 45.53,15.43 45.53,16.29 Q2.2
  Top 1.778: 46.8,14.16 46.8,16.06
WIFI_RST  (via drill 0.3)
  Top 0.203: WIFI.2 46.27,11.01 R6.1 45.28,10.86 v45.15,10.98 | U1.39 67.41,30.96 v67.12,30.67 | v64.58,20.51 v64.58,16.7 | v54.42,9.08 v56.96,9.08
  Bottom 0.203: v67.12,30.67 64.58,28.13 v64.58,20.51 | v64.58,16.7 64.58,14.16 59.5,9.08 v56.96,9.08 | v45.15,10.98 48.58,10.98 48.7,11.11 49.97,11.11 50.48,10.6 52.9,10.6 v54.42,9.08

### Text on the board
bPlace: 915MHz | 868MHz | 433MHz | RESET | IO0 | RXD | TXD | GND | VCC | RS485-LoRa | Wireless Station V2.1 | www.makerfabs.com
tNames: A | B | 5V | B+ | - | + | ON | OFF | GND | BAT | B- | SOLAR